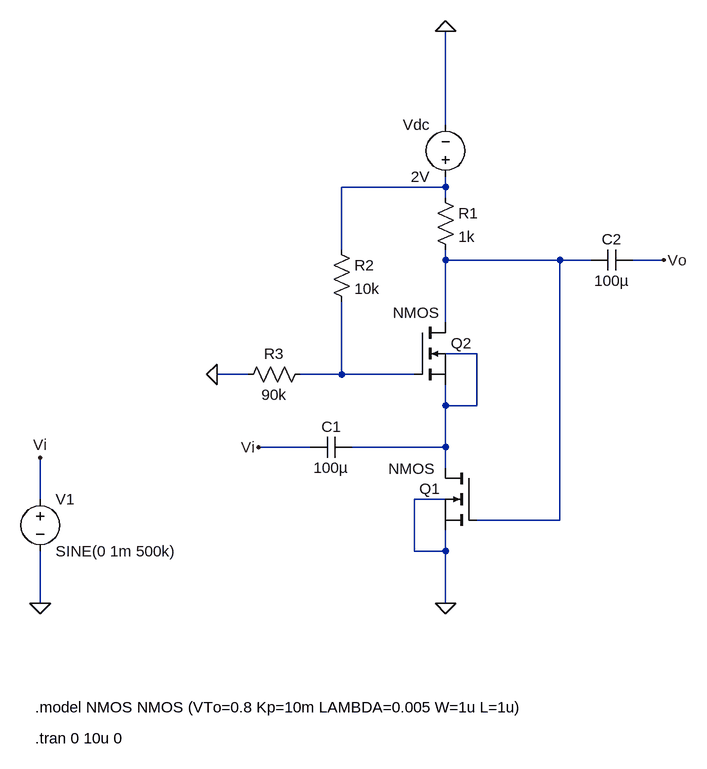
[diagram p0: schematic Elec2_Project2_400100616_400107553.asc]
Elec2_Project2_400100616_400107553.asc, the LTspice schematic file:
Version 4
SHEET 1 880 1016
WIRE 384 48 384 -96
WIRE 384 144 384 128
WIRE 384 144 224 144
WIRE 384 160 384 144
WIRE 224 240 224 144
WIRE 384 256 384 240
WIRE 560 256 384 256
WIRE 608 256 560 256
WIRE 720 256 672 256
WIRE 384 352 384 256
WIRE 432 400 384 400
WIRE 80 432 32 432
WIRE 224 432 224 320
WIRE 224 432 160 432
WIRE 336 432 224 432
WIRE 384 480 384 448
WIRE 432 480 432 400
WIRE 432 480 384 480
WIRE 176 544 96 544
WIRE 384 544 384 480
WIRE 384 544 240 544
WIRE 384 576 384 544
WIRE -240 624 -240 560
WIRE 384 624 336 624
WIRE 560 656 560 256
WIRE 560 656 432 656
WIRE 336 704 336 624
WIRE 384 704 384 672
WIRE 384 704 336 704
WIRE -240 784 -240 704
WIRE 384 784 384 704
FLAG 384 -96 0
FLAG 384 784 0
FLAG 32 432 0
FLAG 96 544 Vi
FLAG 720 256 Vo
FLAG -240 784 0
FLAG -240 560 Vi
SYMBOL voltage 384 144 R180
WINDOW 0 24 96 Left 2
WINDOW 3 24 16 Left 2
SYMATTR InstName Vdc
SYMATTR Value 2V
SYMBOL nmos 336 352 R0
WINDOW 3 -33 -15 Left 2
SYMATTR InstName Q2
SYMBOL nmos 432 576 M0
WINDOW 3 64 1 Left 2
SYMATTR InstName Q1
SYMBOL res 368 144 R0
SYMATTR InstName R1
SYMATTR Value 1k
SYMBOL res 176 416 R90
WINDOW 0 0 56 VBottom 2
WINDOW 3 32 56 VTop 2
SYMATTR InstName R3
SYMATTR Value 90k
SYMBOL cap 176 560 R270
WINDOW 0 32 32 VTop 2
WINDOW 3 0 32 VBottom 2
SYMATTR InstName C1
SYMATTR Value 100µ
SYMBOL cap 672 240 R90
WINDOW 0 0 32 VBottom 2
WINDOW 3 32 32 VTop 2
SYMATTR InstName C2
SYMATTR Value 100µ
SYMBOL res 208 224 R0
SYMATTR InstName R2
SYMATTR Value 10k
SYMBOL voltage -240 608 R0
SYMATTR InstName V1
SYMATTR Value SINE(0 1m 500k)
TEXT -248 944 Left 2 !.model NMOS NMOS (VTo=0.8 Kp=10m LAMBDA=0.005 W=1u L=1u)
TEXT -248 992 Left 2 !.tran 0 10u 0

The netlist it stands for:
* Elec2_Project2_400100616_400107553.asc
Vdc N001 0 2V
M§Q2 N002 N004 N003 N003 NMOS
M§Q1 N003 N002 0 0 NMOS
R1 N001 N002 1k
R3 N004 0 90k
C1 Vi N003 100µ
C2 Vo N002 100µ
R2 N001 N004 10k
V1 Vi 0 SINE(0 1m 500k)
.model NMOS NMOS
.model PMOS PMOS
.lib standard.mos
.model NMOS NMOS (VTo=0.8 Kp=10m LAMBDA=0.005 W=1u L=1u)
.tran 0 10u 0
.backanno
.end